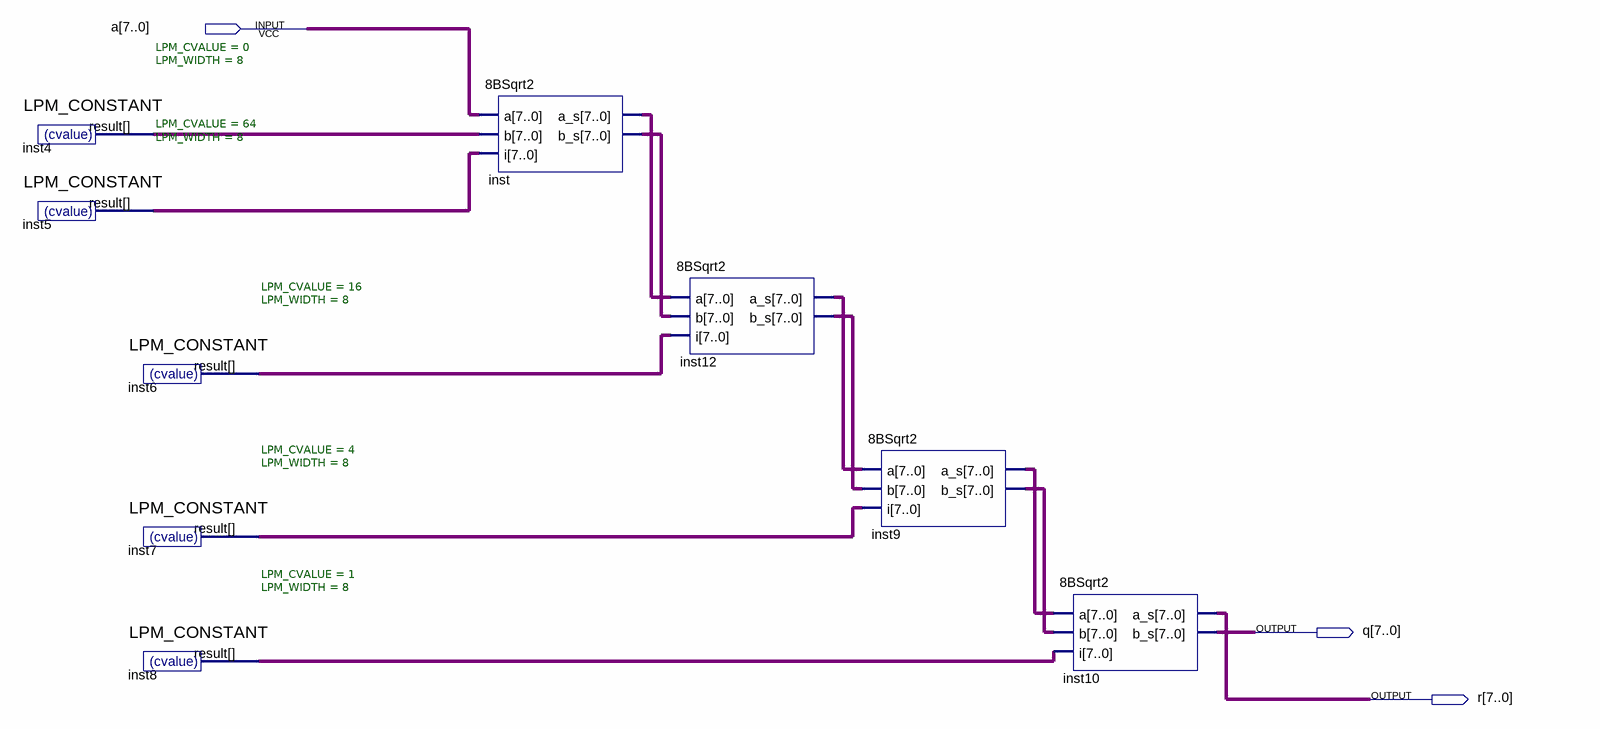
[diagram p0: schematic sheet]
// Quartus schematic 8BSqrt.bdf as structural Verilog: 9 symbols, 3 pins
module \8BSqrt  (
  input  [7:0] a,
  output [7:0] q,
  output [7:0] r
);

  wire [7:0] inst4_result, inst5_result, inst6_result, inst7_result, inst8_result, inst9_a_s, inst9_b_s,
       inst12_a_s, inst12_b_s, inst_a_s, inst_b_s;

  LPM_CONSTANT #(.LPM_CVALUE(0), .LPM_WIDTH(8)) inst4 (.result(inst4_result));
  LPM_CONSTANT #(.LPM_CVALUE(64), .LPM_WIDTH(8)) inst5 (.result(inst5_result));
  LPM_CONSTANT #(.LPM_CVALUE(16), .LPM_WIDTH(8)) inst6 (.result(inst6_result));
  LPM_CONSTANT #(.LPM_CVALUE(4), .LPM_WIDTH(8)) inst7 (.result(inst7_result));
  LPM_CONSTANT #(.LPM_CVALUE(1), .LPM_WIDTH(8)) inst8 (.result(inst8_result));
  \8BSqrt2  inst (.a(a), .b(inst4_result), .i(inst5_result), .a_s(inst_a_s), .b_s(inst_b_s));
  \8BSqrt2  inst12 (.a(inst_a_s), .b(inst_b_s), .i(inst6_result), .a_s(inst12_a_s), .b_s(inst12_b_s));
  \8BSqrt2  inst9 (.a(inst12_a_s), .b(inst12_b_s), .i(inst7_result), .a_s(inst9_a_s), .b_s(inst9_b_s));
  \8BSqrt2  inst10 (.a(inst9_a_s), .b(inst9_b_s), .i(inst8_result), .a_s(r), .b_s(q));
endmodule
